# Altium project Placa_Final_Embebidos.PrjPcb
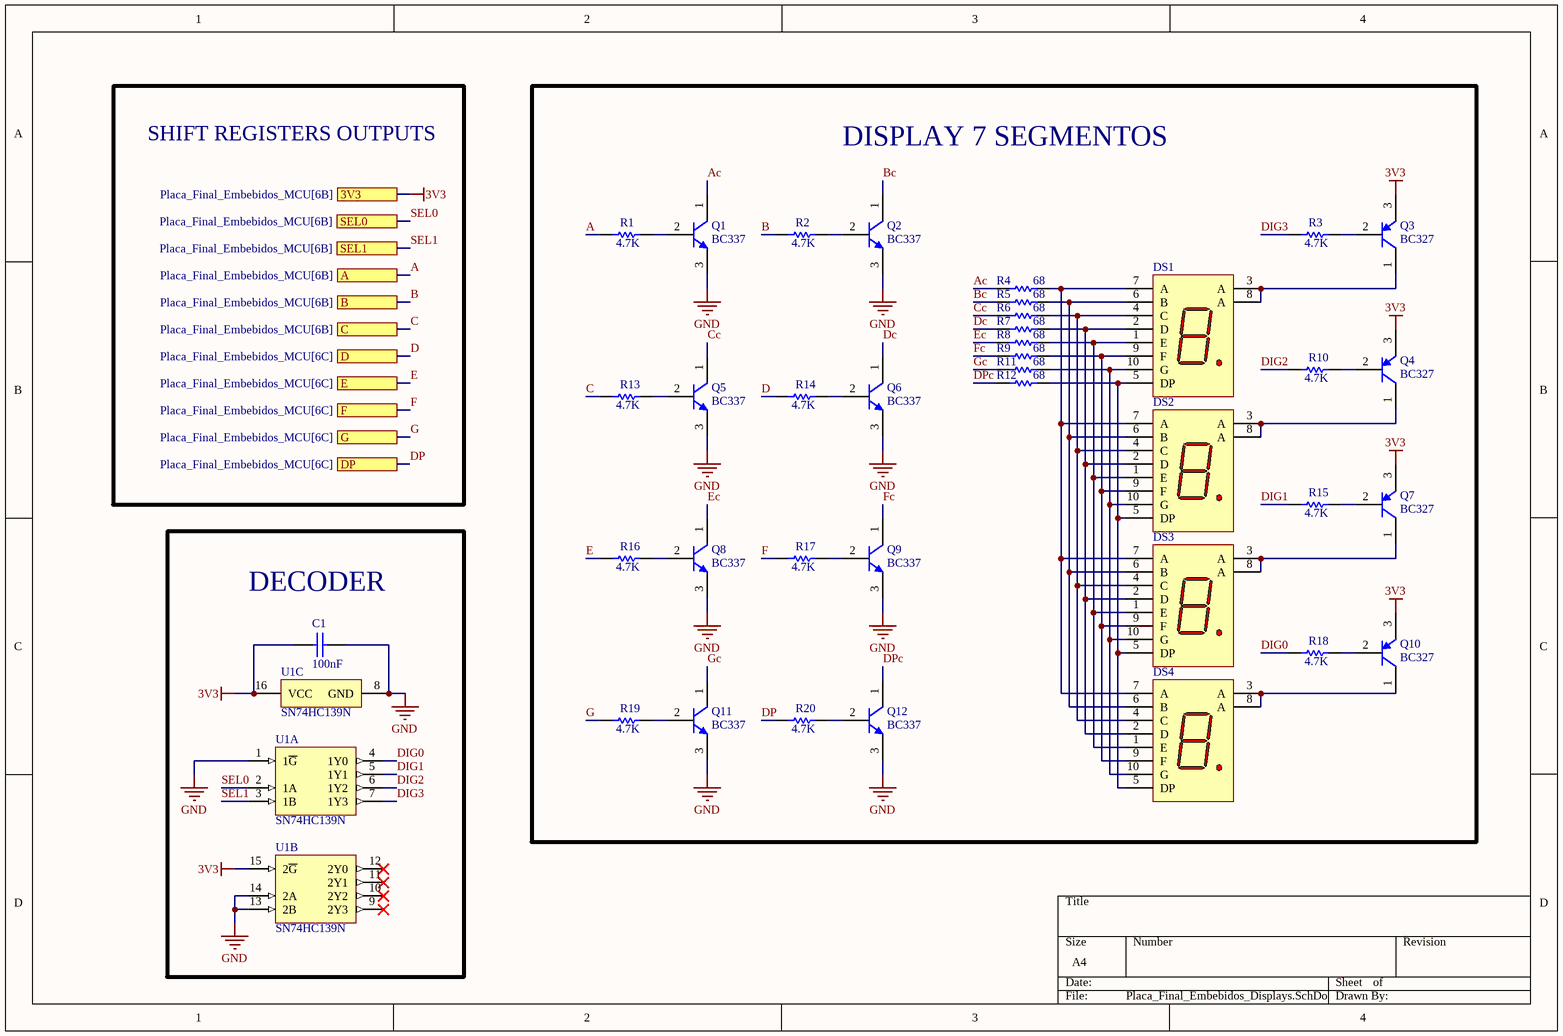
[diagram p0: Placa_Final_Embebidos_Displays.SchDoc]
2 sheets, 77 parts. Net scope: flat (ports and power ports of the same name join across sheets).
Board file: Placa_Final_Embebidos.PcbDoc
Sheets:
  Placa_Final_Embebidos_Displays.SchDoc
  Placa_Final_Embebidos_MCU.SchDoc

## Sheet Placa_Final_Embebidos_Displays.SchDoc
size A4; SheetNumber: 1; SheetTotal: 2

### Parts
C1  100nF  [CAP200]
DS1  (no value)  [WL-T7DS_L17.5W12.4H7]
DS2  (no value)  [WL-T7DS_L17.5W12.4H7]
DS3  (no value)  [WL-T7DS_L17.5W12.4H7]
DS4  (no value)  [WL-T7DS_L17.5W12.4H7]
Q1  BC337  [ONSC-TO-92-3-29-11_AM_BL]
Q2  BC337  [ONSC-TO-92-3-29-11_AM_BL]
Q3  BC327  [ONSC-TO-92-3-29-11_AM_BL]
Q4  BC327  [ONSC-TO-92-3-29-11_AM_BL]
Q5  BC337  [ONSC-TO-92-3-29-11_AM_BL]
Q6  BC337  [ONSC-TO-92-3-29-11_AM_BL]
Q7  BC327  [ONSC-TO-92-3-29-11_AM_BL]
Q8  BC337  [ONSC-TO-92-3-29-11_AM_BL]
Q9  BC337  [ONSC-TO-92-3-29-11_AM_BL]
Q10  BC327  [ONSC-TO-92-3-29-11_AM_BL]
Q11  BC337  [ONSC-TO-92-3-29-11_AM_BL]
Q12  BC337  [ONSC-TO-92-3-29-11_AM_BL]
R1  4.7K  [RES400]
R2  4.7K  [RES400]
R3  4.7K  [RES400]
R4  68  [RES400]
R5  68  [RES400]
R6  68  [RES400]
R7  68  [RES400]
R8  68  [RES400]
R9  68  [RES400]
R10  4.7K  [RES400]
R11  68  [RES400]
R12  68  [RES400]
R13  4.7K  [RES400]
R14  4.7K  [RES400]
R15  4.7K  [RES400]
R16  4.7K  [RES400]
R17  4.7K  [RES400]
R18  4.7K  [RES400]
R19  4.7K  [RES400]
R20  4.7K  [RES400]
U1  SN74HC139N  [N0016A]  (parts A,B,C of 3)

### Blocks framed on the sheet
DISPLAY 7 SEGMENTOS: DS1-DS4 Q1-Q12 R1-R20
DECODER: C1 U1

### Ports
3V3 (see Placa_Final_Embebidos_MCU[6B]), A (see Placa_Final_Embebidos_MCU[6B]), B (see Placa_Final_Embebidos_MCU[6B]), C (see Placa_Final_Embebidos_MCU[6B]), D (see Placa_Final_Embebidos_MCU[6C]), DP (see Placa_Final_Embebidos_MCU[6C]), E (see Placa_Final_Embebidos_MCU[6C]), F (see Placa_Final_Embebidos_MCU[6C]), G (see Placa_Final_Embebidos_MCU[6C]), SEL0 (see Placa_Final_Embebidos_MCU[6B]), SEL1 (see Placa_Final_Embebidos_MCU[6B])

### Nets
3V3: C1.1 Q3.3(E) Q4.3(E) Q7.3(E) Q10.3(E) U1.15(2~{G}) U1.16(VCC) ; port 3V3
GND: C1.2 Q1.3(E) Q2.3(E) Q5.3(E) Q6.3(E) Q8.3(E) Q9.3(E) Q11.3(E) Q12.3(E) U1.1(1~{G}) U1.8(GND) U1.13(2B) U1.14(2A)
A: R1.1 ; port A
Ac: Q1.1(C) R4.1
B: R2.1 ; port B
Bc: Q2.1(C) R5.1
C: R13.1 ; port C
Cc: Q5.1(C) R6.1
D: R14.1 ; port D
Dc: Q6.1(C) R7.1
DIG0: R18.1 U1.4(1Y0)
DIG1: R15.1 U1.5(1Y1)
DIG2: R10.1 U1.6(1Y2)
DIG3: R3.1 U1.7(1Y3)
DP: R20.1 ; port DP
DPc: Q12.1(C) R12.1
E: R16.1 ; port E
Ec: Q8.1(C) R8.1
F: R17.1 ; port F
Fc: Q9.1(C) R9.1
G: R19.1 ; port G
Gc: Q11.1(C) R11.1
SEL0: U1.2(1A) ; port SEL0
SEL1: U1.3(1B) ; port SEL1
NetDS1_1: DS1.1(E) DS2.1(E) DS3.1(E) DS4.1(E) R8.2
NetDS1_2: DS1.2(D) DS2.2(D) DS3.2(D) DS4.2(D) R7.2
NetDS1_3: DS1.3(A) DS1.8(A) Q3.1(C)
NetDS1_4: DS1.4(C) DS2.4(C) DS3.4(C) DS4.4(C) R6.2
NetDS1_5: DS1.5(DP) DS2.5(DP) DS3.5(DP) DS4.5(DP) R12.2
NetDS1_6: DS1.6(B) DS2.6(B) DS3.6(B) DS4.6(B) R5.2
NetDS1_7: DS1.7(A) DS2.7(A) DS3.7(A) DS4.7(A) R4.2
NetDS1_9: DS1.9(F) DS2.9(F) DS3.9(F) DS4.9(F) R9.2
NetDS1_10: DS1.10(G) DS2.10(G) DS3.10(G) DS4.10(G) R11.2
NetDS2_3: DS2.3(A) DS2.8(A) Q4.1(C)
NetDS3_3: DS3.3(A) DS3.8(A) Q7.1(C)
NetDS4_3: DS4.3(A) DS4.8(A) Q10.1(C)
NetQ1_2: Q1.2(B) R1.2
NetQ2_2: Q2.2(B) R2.2
NetQ3_2: Q3.2(B) R3.2
NetQ4_2: Q4.2(B) R10.2
NetQ5_2: Q5.2(B) R13.2
NetQ6_2: Q6.2(B) R14.2
NetQ7_2: Q7.2(B) R15.2
NetQ8_2: Q8.2(B) R16.2
NetQ9_2: Q9.2(B) R17.2
NetQ10_2: Q10.2(B) R18.2
NetQ11_2: Q11.2(B) R19.2
NetQ12_2: Q12.2(B) R20.2

Not connected (* = marked no-connect by the designer): U1 9(2Y3)* 10(2Y2)* 11(2Y1)* 12(2Y0)*

### Notes on the sheet
- SHIFT REGISTERS OUTPUTS

### Library data of the parts
C1 = CAP
DS1-DS4 = CMP-03913-119893999-3: 7-Seg Display, Comm Anode, Super Red Rohs Compliant: Yes; Forward Voltage: 2V; Dominant Wavelength: 635nm; Max Reverse Voltage (DC): 5V; Forward Current: 100mA; Luminous Intensity: 20mcd; Width: 12.4mm; Max Operating Temperature: 85°C; Min Operating Temperature: -40°C; Height: 7mm; RoHS: Compliant; Length: 17.5mm
Q1 Q2 Q5 Q6 Q8 Q9 Q11 Q12 = CMP-1048-01583-1: Amplifier Transistor, NPN Silicon, 3-Pin TO-92, Pb-Free, Ammo Box; PartNumber: BC337-40ZL1G; Manufacturer: On Semiconductor; IC Continuous (A): 0.8; ComponentLink2URL: http://www.onsemi.com/pub_link/Collateral/BC337-D.PDF; PackageReference: TO-92-3-29-11_AM_BL; ComponentLink1Description: Manufacturer URL; RoHS: TRUE; PackageVersion: Rev. AM; ComponentLink3URL: http://www.onsemi.com/pub_link/Collateral/MAC97-D.PDF; ComponentLink3Description: Package Specification; Packing: Ammo Box; DatasheetVersion: Rev. 8; Polarity: NPN; ComponentLink1URL: http://www.onsemi.com/; ComponentLink2Description: Datasheet; PackageDescription: 3-Pin Transistor Outline, Body 4.825 x 3.685 mm, Pitch 1.27 mm; Mounting Technology: Through Hole
Q3 Q4 Q7 Q10 = CMP-1048-01577-1: Amplifier Transistor, PNP Silicon, 3-Pin TO-92, Pb-Free, Ammo Box; Manufacturer: On Semiconductor; PartNumber: BC327-25ZL1G; IC Continuous (A): -0.8; ComponentLink2URL: http://www.onsemi.com/pub_link/Collateral/BC327-D.PDF; ComponentLink1Description: Manufacturer URL; PackageReference: TO-92-3-29-11_AM_BL; Polarity: PNP; ComponentLink1URL: http://www.onsemi.com/; ComponentLink3Description: Package Specification; PackageDescription: 3-Pin Transistor Outline, Body 4.825 x 3.685 mm, Pitch 1.27 mm; PackageVersion: Rev. AM; ComponentLink3URL: http://www.onsemi.com/pub_link/Collateral/MAC97-D.PDF; ComponentLink2Description: Datasheet; RoHS: TRUE; DatasheetVersion: Rev. 6; Mounting Technology: Through Hole; Packing: Ammo Box
R1-R20 = RES
U1 = CMP-1633-00660-2: Dual 2-Line To 4-Line Decoders/Demultiplexers, N0016A, TUBE; Manufacturer: Texas Instruments; Technology Family: HC; VCC(Min)(V): 2; Voltage(Nom)(V): 3.3,5; F @ Nom Voltage(Max)(Mhz): 28; Output Type: CMOS; Bits(#): 4; VCC(Max)(V): 6; ICC @ Nom Voltage(Max)(mA): 0.08; Function: Decoder/Demultiplexer; Input Type: LVTTL/CMOS; Output Drive (IOL/IOH)(Max)(mA): 5.2/-5.2; Schmitt Trigger: No; Rating: Catalog; Configuration: 2：4; tpd @ Nom Voltage(Max)(ns): 44; Code_JEDEC: MS-001; DatasheetVersion: SCLS108D; Generic Part Number: SN74HC139; Operating Temperature Range(C): -40 to 85; PackageReference: N0016A; Channels(#): 2; Type: Standard

## Sheet Placa_Final_Embebidos_MCU.SchDoc
size 420 x 297 mm; SheetNumber: 2; SheetTotal: 2
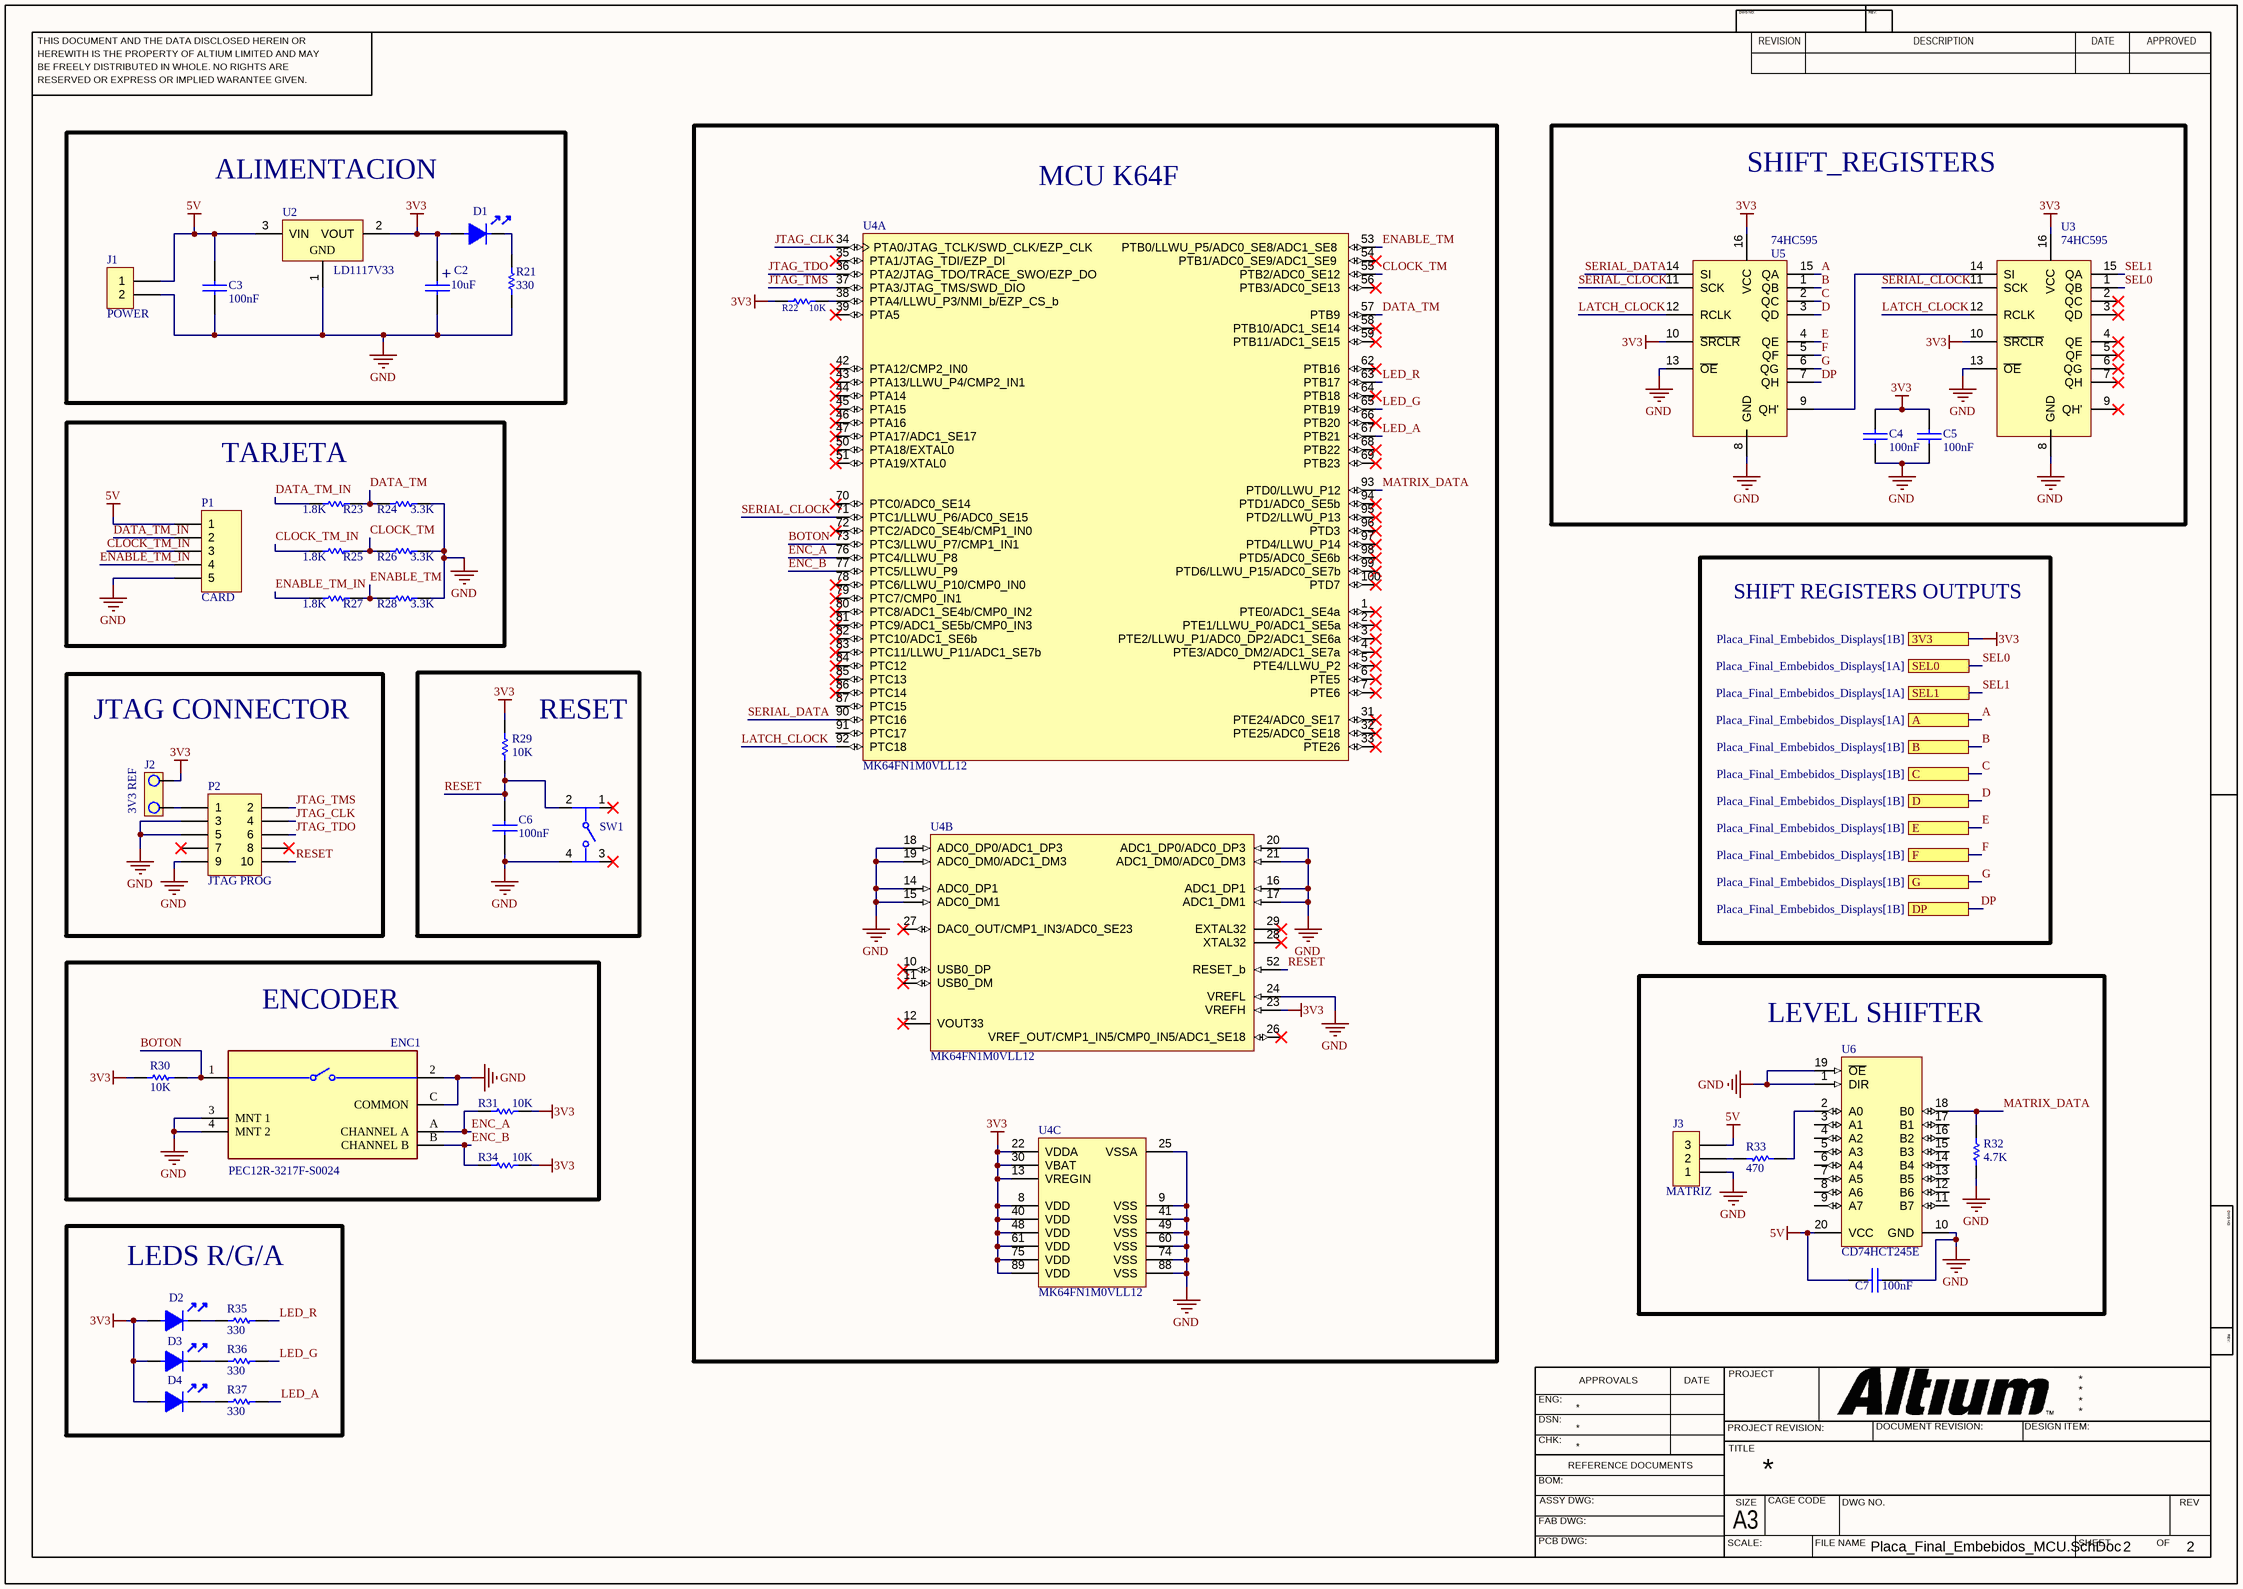
[diagram p1: Placa_Final_Embebidos_MCU.SchDoc]

### Parts
C2  10uF  [CAP100RP]
C3  100nF  [CAP200]
C4  100nF  [CAP200]
C5  100nF  [CAP200]
C6  100nF  [CAP200]
C7  100nF  [CAP200]
D1  (no value)  [LED3]
D2  (no value)  [LED3]
D3  (no value)  [LED3]
D4  (no value)  [LED3]
ENC1  PEC12R-3217F-S0024  [FP-PEC12R-3217F-S0024-MFG]
J1  POWER  [BORNERA2]
J2  3V3 REF  [JUMPER2]
J3  MATRIZ  [SIP3]
P1  CARD  [HDR1X5]
P2  JTAG PROG  [HDR2X5]
R21  330  [RES400]
R22  10K  [RES400]
R23  1.8K  [RES400]
R24  3.3K  [RES400]
R25  1.8K  [RES400]
R26  3.3K  [RES400]
R27  1.8K  [RES400]
R28  3.3K  [RES400]
R29  10K  [RES400]
R30  10K  [RES400]
R31  10K  [RES400]
R32  4.7K  [RES400]
R33  470  [RES400]
R34  10K  [RES400]
R35  330  [RES400]
R36  330  [RES400]
R37  330  [RES400]
SW1  (no value)  [FP-B3F-1055-MFG]
U2  LD1117V33  [TO220]
U3  74HC595  [DIP16]
U4  MK64FN1M0VLL12  [K64F_DevBoard_Headers_MIRROR]  (parts A,B,C of 3)
U5  74HC595  [DIP16]
U6  CD74HCT245E  [N0020A]

### Blocks framed on the sheet
ALIMENTACION: C2 C3 D1 J1 R21 U2
MCU K64F: R22 U4
SHIFT_REGISTERS: C4 C5 U3 U5
TARJETA: P1 R23-R28
JTAG CONNECTOR: J2 P2
RESET: C6 R29 SW1
ENCODER: ENC1 R30 R31 R34
LEVEL SHIFTER: C7 J3 R32 R33 U6
LEDS R/G/A: D2-D4 R35-R37

### Ports
3V3 (see Placa_Final_Embebidos_Displays[1B]), A (see Placa_Final_Embebidos_Displays[1A]), B (see Placa_Final_Embebidos_Displays[1B]), C (see Placa_Final_Embebidos_Displays[1B]), D (see Placa_Final_Embebidos_Displays[1B]), DP (see Placa_Final_Embebidos_Displays[1B]), E (see Placa_Final_Embebidos_Displays[1B]), F (see Placa_Final_Embebidos_Displays[1B]), G (see Placa_Final_Embebidos_Displays[1B]), SEL0 (see Placa_Final_Embebidos_Displays[1A]), SEL1 (see Placa_Final_Embebidos_Displays[1A])

### Nets
3V3: C2.1 C4.2 C5.2 D1.1 D2.1 D3.1 D4.1 J2.1 R22.2 R29.2 R30.1 R31.2 R34.1 U2.2(VOUT) U3.10(~{SRCLR}) U3.16(VCC) U4.8(VDD) U4.13(VREGIN) U4.22(VDDA) U4.23(VREFH) U4.30(VBAT) U4.40(VDD) U4.48(VDD) U4.61(VDD) U4.75(VDD) U4.89(VDD) U5.10(~{SRCLR}) U5.16(VCC) ; port 3V3
5V: C3.1 C7.1 J1.1 J3.3 P1.1 U2.3(VIN) U6.20(VCC)
GND: C2.2 C3.2 C4.1 C5.1 C6.2 C7.2 ENC1.2 ENC1.3(MNT_1) ENC1.4(MNT_2) ENC1.C(COMMON) J1.2 J3.1 P1.5 P2.3 P2.5 P2.9 R21.2 R24.2 R26.2 R28.2 R32.1 SW1.4 U2.1(GND) U3.8(GND) U3.13(~{OE}) U4.9(VSS) U4.14(ADC0_DP1) U4.15(ADC0_DM1) U4.16(ADC1_DP1) U4.17(ADC1_DM1) U4.18(ADC0_DP0/ADC1_DP3) U4.19(ADC0_DM0/ADC1_DM3) U4.20(ADC1_DP0/ADC0_DP3) U4.21(ADC1_DM0/ADC0_DM3) U4.24(VREFL) U4.25(VSSA) U4.41(VSS) U4.49(VSS) U4.60(VSS) U4.74(VSS) U4.88(VSS) U5.8(GND) U5.13(~{OE}) U6.1(DIR) U6.10(GND) U6.19(~{OE})
A: U5.15(QA) ; port A
B: U5.1(QB) ; port B
BOTON: ENC1.1 R30.2 U4.73(PTC3/LLWU_P7/CMP1_IN1)
C: U5.2(QC) ; port C
CLOCK_TM: R25.2 R26.1 U4.55(PTB2/ADC0_SE12)
CLOCK_TM_IN: P1.3 R25.1
D: U5.3(QD) ; port D
DATA_TM: R23.2 R24.1 U4.57(PTB9)
DATA_TM_IN: P1.2 R23.1
DP: U5.7(QH) ; port DP
E: U5.4(QE) ; port E
ENABLE_TM: R27.2 R28.1 U4.53(PTB0/LLWU_P5/ADC0_SE8/ADC1_SE8)
ENABLE_TM_IN: P1.4 R27.1
ENC_A: ENC1.A(CHANNEL_A) R31.1 U4.76(PTC4/LLWU_P8)
ENC_B: ENC1.B(CHANNEL_B) R34.2 U4.77(PTC5/LLWU_P9)
F: U5.5(QF) ; port F
G: U5.6(QG) ; port G
JTAG_CLK: P2.4 U4.34(PTA0/JTAG_TCLK/SWD_CLK/EZP_CLK)
JTAG_TDO: P2.6 U4.36(PTA2/JTAG_TDO/TRACE_SWO/EZP_DO)
JTAG_TMS: P2.2 U4.37(PTA3/JTAG_TMS/SWD_DIO)
LATCH_CLOCK: U3.12(RCLK) U4.92(PTC18) U5.12(RCLK)
LED_A: R37.2 U4.67(PTB21)
LED_G: R36.2 U4.65(PTB19)
LED_R: R35.2 U4.63(PTB17)
MATRIX_DATA: R32.2 U4.93(PTD0/LLWU_P12) U6.18(B0)
RESET: C6.1 P2.10 R29.1 SW1.2 U4.52(RESET_b)
SEL0: U3.1(QB) ; port SEL0
SEL1: U3.15(QA) ; port SEL1
SERIAL_CLOCK: U3.11(SCK) U4.71(PTC1/LLWU_P6/ADC0_SE15) U5.11(SCK)
SERIAL_DATA: U4.90(PTC16) U5.14(SI)
NetD1_2: D1.2 R21.1
NetD2_2: D2.2 R35.1
NetD3_2: D3.2 R36.1
NetD4_2: D4.2 R37.1
NetJ2_2: J2.2 P2.1
NetJ3_2: J3.2 R33.1
NetR22_1: R22.1 U4.38(PTA4/LLWU_P3/NMI_b/EZP_CS_b)
NetR33_2: R33.2 U6.2(A0)
NetU3_14: U3.14(SI) U5.9(QH')

Not connected (* = marked no-connect by the designer): P2 7* 8*; SW1 1* 3*; U3 2(QC)* 3(QD)* 4(QE)* 5(QF)* 6(QG)* 7(QH)* 9(QH')*; U4 1(PTE0/ADC1_SE4a)* 2(PTE1/LLWU_P0/ADC1_SE5a)* 3(PTE2/LLWU_P1/ADC0_DP2/ADC1_SE6a)* 4(PTE3/ADC0_DM2/ADC1_SE7a)* 5(PTE4/LLWU_P2)* 6(PTE5)* 7(PTE6)* 10(USB0_DP)* 11(USB0_DM)* 12(VOUT33)* 26(VREF_OUT/CMP1_IN5/CMP0_IN5/ADC1_SE18)* 27(DAC0_OUT/CMP1_IN3/ADC0_SE23)* 28(XTAL32)* 29(EXTAL32)* 31(PTE24/ADC0_SE17)* 32(PTE25/ADC0_SE18)* 33(PTE26)* 35(PTA1/JTAG_TDI/EZP_DI)* 39(PTA5)* 42(PTA12/CMP2_IN0)* 43(PTA13/LLWU_P4/CMP2_IN1)* 44(PTA14)* 45(PTA15)* 46(PTA16)* 47(PTA17/ADC1_SE17_)* 50(PTA18/EXTAL0_)* 51(PTA19/XTAL0)* 54(PTB1/ADC0_SE9/ADC1_SE9_)* 56(PTB3/ADC0_SE13)* 58(PTB10/ADC1_SE14)* 59(PTB11/ADC1_SE15)* 62(PTB16)* 64(PTB18)* 66(PTB20)* 68(PTB22)* 69(PTB23)* 70(PTC0/ADC0_SE14)* 72(PTC2/ADC0_SE4b/CMP1_IN0)* 78(PTC6/LLWU_P10/CMP0_IN0)* 79(PTC7/CMP0_IN1)* 80(PTC8/ADC1_SE4b/CMP0_IN2_)* 81(PTC9/ADC1_SE5b/CMP0_IN3)* 82(PTC10/ADC1_SE6b)* 83(PTC11/LLWU_P11/ADC1_SE7b_)* 84(PTC12)* 85(PTC13)* 86(PTC14)* 87(PTC15) 91(PTC17) 94(PTD1/ADC0_SE5b)* 95(PTD2/LLWU_P13)* 96(PTD3)* 97(PTD4/LLWU_P14)* 98(PTD5/ADC0_SE6b)* 99(PTD6/LLWU_P15/ADC0_SE7b)* 100(PTD7)*; U6 3(A1) 4(A2) 5(A3) 6(A4) 7(A5) 8(A6) 9(A7) 11(B7) 12(B6) 13(B5) 14(B4) 15(B3) 16(B2) 17(B1)

### Notes on the sheet
- SHIFT REGISTERS OUTPUTS
- THIS DOCUMENT AND THE DATA DISCLOSED HEREIN OR
- HEREWITH IS THE PROPERTY OF ALTIUM LIMITED AND MAY
- DWG NO:
- REVISION
- REV:
- DESCRIPTION
- DATE
- APPROVED
- BE FREELY DISTRIBUTED IN WHOLE. NO RIGHTS ARE
- RESERVED OR EXPRESS OR IMPLIED WARANTEE GIVEN.
- ENG:
- APPROVALS
- PROJECT
- DSN:
- CHK:
- REFERENCE DOCUMENTS
- PROJECT REVISION:
- TITLE
- DOCUMENT REVISION:
- DESIGN ITEM:
- BOM:
- FAB DWG:
- PCB DWG:
- ASSY DWG:
- SCALE:
- A3
- SIZE
- CAGE CODE
- FILE NAME
- DWG NO.
- SHEET
- OF
- REV
- (in symbol CAPPOL) +

### Library data of the parts
C2 = CAPPOL
C3-C7 = CAP
D1-D4 = LED
ENC1 = CMP-07421-000063-1: ROTARY ENCODER; Height: 13.4mm; Width: 12.5mm; Length: 23mm; RoHS Compliant: Yes
J1 = BORNERA 2
J2 = JUMPER
J3 = CON3
P1 = Header 5: Header, 5-Pin; LatestRevisionDate: 17-Jul-2002; LatestRevisionNote: Re-released for DXP Platform.; Publisher: Altium Limited
P2 = Header 5X2: Header, 5-Pin, Dual row; LatestRevisionDate: 17-Jul-2002; LatestRevisionNote: Re-released for DXP Platform.; Publisher: Altium Limited
R21-R37 = RES
SW1 = CMP-08834-000061-1: SWITCH TACTILE SPST-NO 0.05A 24V; Switch Travel: 0.25mm; Mechanical Life: 100000Cycles; Max Current Rating: 50mA; Actuator Color: Orange; Throw Configuration: SPST; Switch Function: Off-Mom; Contact Resistance: 100mR; Number of Poles: 1; Operating Force: 2.55N; Illumination Type: Non-Illuminated; Electrical Life: 300000Cycles; Actuator Length: 3mm; Termination: PC Pins; Contact Plating: Silver; Depth: 6mm; Max Voltage Rating (DC): 24V; Voltage Rating (DC): 24V; Package Quantity: 1500; Lead Free: Lead Free; Min Operating Temperature: -25°C; Max Operating Temperature: 70°C; Mount: Through Hole; Series: B3F; Contact Current Rating: 50mA; Orientation: Straight; Width: 6mm; RoHS Compliant: Yes; Contact Type: 1 maker; Weight: 0.25g; Packaging: Bag; Contact Material: Gold; Length: 6mm; Height: 7.3mm; Current Rating: 50mA
U2 = CMP-0244-00470-1: Fixed Low Drop Positive Voltage Regulator, 3.3V, 3-Pin TO-220; PackageVersion: ver3.0; PackageDescription: TO, Thru-Hole, Vertical, Heatsink Mounted; 3 In-Line Leads; Pitch 2.54 mm; ComponentLink1Description: Manufacturer URL; ComponentLink3URL: http://www.st.com/internet/com/TECHNICAL_RESOURCES/TECHNICAL_LITERATURE/PACKAGE_INFORMATION/CD00004649.pdf; PackageReference: TO220; ComponentLink2URL: http://www.st.com/internet/com/TECHNICAL_RESOURCES/TECHNICAL_LITERATURE/DATASHEET/CD00000544.pdf; ComponentLink3Description: Package Specification; ComponentLink2Description: Datasheet; ComponentLink1URL: http://www.st.com; DatasheetVersion: 1/11/2011
U4 = CMP-0182-00049-1: Cortex-M4-based Microcontroller with FPU, 1 MB, 120 MHz, 1.71 to 3.6 V, -40 to 105 degC, 100-Pin QFP (983-02), RoHS, Tray; Manufacturer: Freescale Semiconductor; SRAM: 256 KB; Flash: 1 MB; VBAT: 1.71 to 3.6 V; DatasheetVersion: Rev. 3; ComponentLink1URL: http://www.freescale.com/; VDD: 1.71 to 3.6 V; VDDA: 1.71 to 3.6 V; ComponentLink1Description: Manufacturer URL; Packing: Tray; ComponentLink2Description: Datasheet; Temperature Range: -40 to 105 degC; PackageVersion: Rev. J; PackageDescription: 100-Pin Plastic Quad Flat Package, Body 14 x 14 mm, Pitch 0.5 mm; PartNumber: MK64FN1M0VLL12; ComponentLink3URL: http://cache.freescale.com/files/shared/doc/package_info/98ASS23308W.pdf; ComponentLink2URL: http://cache.freescale.com/files/microcontrollers/doc/data_sheet/K64P144M120SF5.pdf?pspll=1; ComponentLink3Description: Package Specification; RoHS: TRUE; Mounting Technology: Surface Mount
U6 = CMP-1620-00444-2: High Speed CMOS Logic Non-Inverting Octal-Bus Transceiver with 3-State Outpus, N0020A, TUBE; Manufacturer: Texas Instruments; F @ Nom Voltage(Max)(Mhz): 25; Voltage(Nom)(V): 5; ICC @ Nom Voltage(Max)(mA): 0.08; Rating: Catalog; VCC(Min)(V): 4.5; Schmitt Trigger: No; Technology Family: HCT; VCC(Max)(V): 5.5; Output Drive (IOL/IOH)(Max)(mA): -4/4; Bits(#): 8; tpd @ Nom Voltage(Max)(ns): 33; Input Type: TTL; Operating Temperature Range(C): -55 to 125; Code_JEDEC: MS-001; Output Type: CMOS; Generic Part Number: CD74HCT245; PackageReference: N0020A; DatasheetVersion: SCHS119A

## Nets that join several sheets
3V3: Placa_Final_Embebidos_Displays (7 pins), Placa_Final_Embebidos_MCU (28 pins)
GND: Placa_Final_Embebidos_Displays (13 pins), Placa_Final_Embebidos_MCU (46 pins)
A: Placa_Final_Embebidos_Displays (R1.1), Placa_Final_Embebidos_MCU (U5.15)
B: Placa_Final_Embebidos_Displays (R2.1), Placa_Final_Embebidos_MCU (U5.1)
C: Placa_Final_Embebidos_Displays (R13.1), Placa_Final_Embebidos_MCU (U5.2)
D: Placa_Final_Embebidos_Displays (R14.1), Placa_Final_Embebidos_MCU (U5.3)
DP: Placa_Final_Embebidos_Displays (R20.1), Placa_Final_Embebidos_MCU (U5.7)
E: Placa_Final_Embebidos_Displays (R16.1), Placa_Final_Embebidos_MCU (U5.4)
F: Placa_Final_Embebidos_Displays (R17.1), Placa_Final_Embebidos_MCU (U5.5)
G: Placa_Final_Embebidos_Displays (R19.1), Placa_Final_Embebidos_MCU (U5.6)
SEL0: Placa_Final_Embebidos_Displays (U1.2), Placa_Final_Embebidos_MCU (U3.1)
SEL1: Placa_Final_Embebidos_Displays (U1.3), Placa_Final_Embebidos_MCU (U3.15)